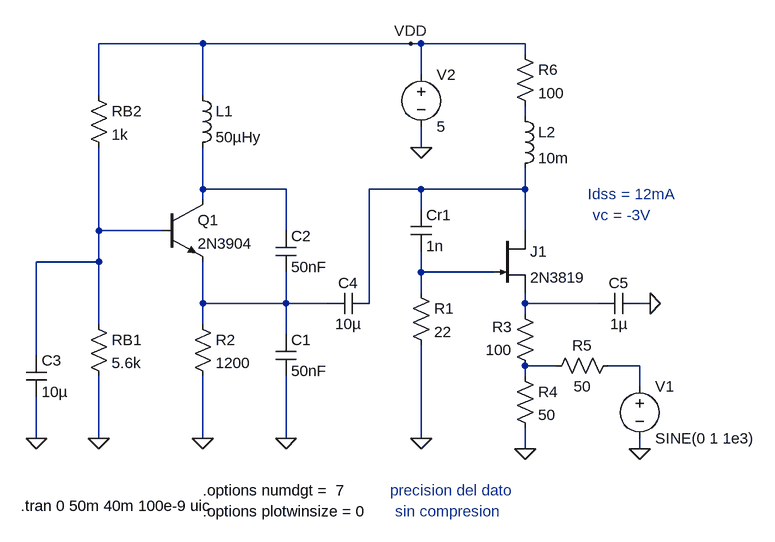
[diagram p0: schematic FM_directa.asc]
FM_directa.asc, the LTspice schematic file:
Version 4
SHEET 1 880 680
WIRE -48 -208 -208 -208
WIRE 272 -208 -48 -208
WIRE 288 -208 272 -208
WIRE 448 -208 288 -208
WIRE 448 -192 448 -208
WIRE 288 -160 288 -208
WIRE -208 -128 -208 -208
WIRE -48 -128 -48 -208
WIRE 448 -96 448 -112
WIRE 288 -48 288 -80
WIRE -48 16 -48 -48
WIRE 80 16 -48 16
WIRE 288 16 208 16
WIRE 448 16 448 -16
WIRE 448 16 288 16
WIRE -48 32 -48 16
WIRE 288 48 288 16
WIRE -208 80 -208 -48
WIRE -112 80 -208 80
WIRE 80 80 80 16
WIRE 448 80 448 16
WIRE -208 128 -208 80
WIRE -208 128 -304 128
WIRE 288 144 288 112
WIRE 400 144 288 144
WIRE 288 176 288 144
WIRE -48 192 -48 128
WIRE 80 192 80 144
WIRE 80 192 -48 192
WIRE 144 192 80 192
WIRE 208 192 208 16
WIRE 448 192 448 176
WIRE 560 192 448 192
WIRE 640 192 624 192
WIRE 448 208 448 192
WIRE -208 224 -208 128
WIRE -48 224 -48 192
WIRE 80 240 80 192
WIRE -304 272 -304 128
WIRE 496 288 448 288
WIRE 624 288 576 288
WIRE 448 304 448 288
WIRE 624 320 624 288
WIRE -304 400 -304 336
WIRE -208 400 -208 304
WIRE -48 400 -48 304
WIRE 80 400 80 304
WIRE 288 400 288 256
WIRE 448 416 448 384
WIRE 624 416 624 400
FLAG 288 400 0
FLAG 448 416 0
FLAG -48 400 0
FLAG -208 400 0
FLAG -304 400 0
FLAG 80 400 0
FLAG 272 -208 VDD
FLAG 624 416 0
FLAG 288 -48 0
FLAG 640 192 0
SYMBOL ind -64 -144 R0
SYMATTR InstName L1
SYMATTR Value 50µHy
SYMBOL cap 272 48 R0
SYMATTR InstName Cr1
SYMATTR Value 1n
SYMBOL res 272 160 R0
SYMATTR InstName R1
SYMATTR Value 22
SYMBOL res -64 208 R0
SYMATTR InstName R2
SYMATTR Value 1200
SYMBOL res -224 208 R0
SYMATTR InstName RB1
SYMATTR Value 5.6k
SYMBOL res -224 -144 R0
SYMATTR InstName RB2
SYMATTR Value 1k
SYMBOL cap 64 240 R0
SYMATTR InstName C1
SYMATTR Value 50nF
SYMBOL cap 64 80 R0
SYMATTR InstName C2
SYMATTR Value 50nF
SYMBOL njf 400 80 R0
SYMATTR InstName J1
SYMATTR Value 2N3819
SYMBOL cap -320 272 R0
SYMATTR InstName C3
SYMATTR Value 10µ
SYMBOL voltage 624 304 R0
WINDOW 123 0 0 Left 0
WINDOW 39 24 124 Left 2
SYMATTR InstName V1
SYMATTR Value SINE(0 1 1e3)
SYMBOL voltage 288 -176 R0
WINDOW 123 0 0 Left 0
WINDOW 39 0 0 Left 0
SYMATTR InstName V2
SYMATTR Value 5
SYMBOL cap 208 176 R90
WINDOW 0 0 32 VBottom 2
WINDOW 3 32 32 VTop 2
SYMATTR InstName C4
SYMATTR Value 10µ
SYMBOL res 464 304 R180
WINDOW 0 36 76 Left 2
WINDOW 3 36 40 Left 2
SYMATTR InstName R3
SYMATTR Value 100
SYMBOL cap 560 208 R270
WINDOW 0 32 32 VTop 2
WINDOW 3 0 32 VBottom 2
SYMATTR InstName C5
SYMATTR Value 1µ
SYMBOL ind 432 -112 R0
SYMATTR InstName L2
SYMATTR Value 10m
SYMBOL npn -112 32 R0
SYMATTR InstName Q1
SYMATTR Value 2N3904
SYMBOL res 432 288 R0
SYMATTR InstName R4
SYMATTR Value 50
SYMBOL res 592 272 R90
WINDOW 0 0 56 VBottom 2
WINDOW 3 32 56 VTop 2
SYMATTR InstName R5
SYMATTR Value 50
SYMBOL res 432 -208 R0
SYMATTR InstName R6
SYMATTR Value 100
TEXT -328 504 Left 2 !.tran 0 50m 40m 100e-9 uic
TEXT 544 24 Left 2 ;Idss = 12mA
TEXT 552 56 Left 2 ;vc = -3V
TEXT -48 480 Left 2 !.options numdgt =  7
TEXT -48 512 Left 2 !.options plotwinsize = 0
TEXT 240 480 Left 2 ;precision del dato
TEXT 248 512 Left 2 ;sin compresion

The netlist it stands for:
* FM_directa.asc
L1 VDD N002 50µHy
Cr1 N003 N005 1n
R1 N005 0 22
R2 N006 0 1200
RB1 N004 0 5.6k
RB2 VDD N004 1k
C1 N006 0 50nF
C2 N002 N006 50nF
J1 N003 N005 N007 2N3819
C3 N004 0 10µ
V1 N009 0 SINE(0 1 1e3)
V2 VDD 0 5
C4 N003 N006 10µ
R3 N008 N007 100
C5 N007 0 1µ
L2 N001 N003 10m
Q1 N002 N004 N006 0 2N3904
R4 N008 0 50
R5 N009 N008 50
R6 VDD N001 100
.model NPN NPN
.model PNP PNP
.lib standard.bjt
.model NJF NJF
.model PJF PJF
.lib standard.jft
.tran 0 50m 40m 100e-9 uic
* Idss = 12mA
* vc = -3V
.options numdgt =  7
.options plotwinsize = 0
* precision del dato
* sin compresion
.backanno
.end